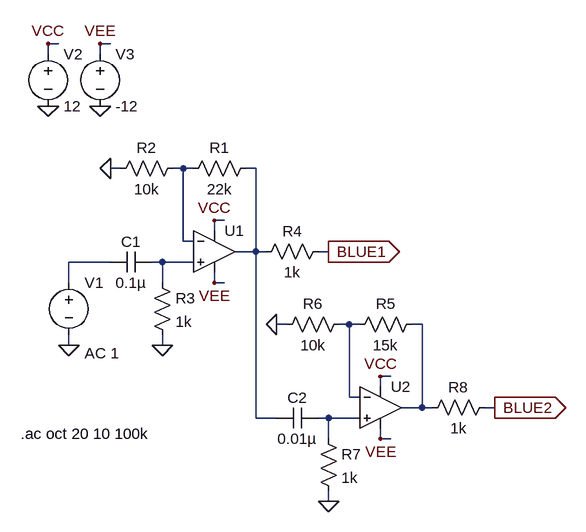
[diagram p0: schematic BlueFilter.asc]
BlueFilter.asc, the LTspice schematic file:
Version 4
SHEET 1 880 680
WIRE 32 -224 16 -224
WIRE 112 -224 96 -224
WIRE 16 -208 16 -224
WIRE 96 -208 96 -224
WIRE 128 -32 112 -32
WIRE 224 -32 208 -32
WIRE 240 -32 224 -32
WIRE 336 -32 320 -32
WIRE 288 48 272 48
WIRE 272 64 272 48
WIRE 224 80 224 -32
WIRE 240 80 224 80
WIRE 336 96 336 -32
WIRE 336 96 304 96
WIRE 352 96 336 96
WIRE 448 96 432 96
WIRE 112 112 48 112
WIRE 192 112 176 112
WIRE 240 112 192 112
WIRE 48 144 48 112
WIRE 192 144 192 112
WIRE 272 144 272 128
WIRE 288 144 272 144
WIRE 384 208 368 208
WIRE 480 208 464 208
WIRE 496 208 480 208
WIRE 592 208 576 208
WIRE 48 240 48 224
WIRE 192 240 192 224
WIRE 544 288 528 288
WIRE 528 304 528 288
WIRE 480 320 480 208
WIRE 496 320 480 320
WIRE 592 336 592 208
WIRE 592 336 560 336
WIRE 608 336 592 336
WIRE 704 336 688 336
WIRE 336 352 336 96
WIRE 368 352 336 352
WIRE 448 352 432 352
WIRE 496 352 448 352
WIRE 448 384 448 352
WIRE 528 384 528 368
WIRE 544 384 528 384
WIRE 448 480 448 464
FLAG 272 48 VCC
FLAG 272 144 VEE
FLAG 112 -32 0
FLAG 192 240 0
FLAG 48 240 0
FLAG 448 96 BLUE1
IOPIN 448 96 Out
FLAG 16 -128 0
FLAG 96 -128 0
FLAG 16 -224 VCC
FLAG 96 -224 VEE
FLAG 528 288 VCC
FLAG 528 384 VEE
FLAG 368 208 0
FLAG 448 480 0
FLAG 704 336 BLUE2
IOPIN 704 336 Out
SYMBOL voltage 48 128 R0
WINDOW 123 24 124 Left 2
WINDOW 39 0 0 Left 0
SYMATTR InstName V1
SYMATTR Value ""
SYMATTR Value2 AC 1
SYMBOL Opamps\\UniversalOpamp2 272 96 R0
SYMATTR InstName U1
SYMBOL res 336 -48 R90
WINDOW 0 0 56 VBottom 2
WINDOW 3 32 56 VTop 2
SYMATTR InstName R1
SYMATTR Value 22k
SYMBOL res 224 -48 R90
WINDOW 0 0 56 VBottom 2
WINDOW 3 32 56 VTop 2
SYMATTR InstName R2
SYMATTR Value 10k
SYMBOL res 176 128 R0
SYMATTR InstName R3
SYMATTR Value 1k
SYMBOL cap 176 96 R90
WINDOW 0 0 32 VBottom 2
WINDOW 3 32 32 VTop 2
SYMATTR InstName C1
SYMATTR Value 0.1µ
SYMBOL res 448 80 R90
WINDOW 0 0 56 VBottom 2
WINDOW 3 32 56 VTop 2
SYMATTR InstName R4
SYMATTR Value 1k
SYMBOL voltage 16 -224 R0
WINDOW 123 0 0 Left 0
WINDOW 39 0 0 Left 0
SYMATTR InstName V2
SYMATTR Value 12
SYMBOL voltage 96 -224 R0
WINDOW 123 0 0 Left 0
WINDOW 39 0 0 Left 0
SYMATTR InstName V3
SYMATTR Value -12
SYMBOL Opamps\\UniversalOpamp2 528 336 R0
SYMATTR InstName U2
SYMBOL res 592 192 R90
WINDOW 0 0 56 VBottom 2
WINDOW 3 32 56 VTop 2
SYMATTR InstName R5
SYMATTR Value 15k
SYMBOL res 480 192 R90
WINDOW 0 0 56 VBottom 2
WINDOW 3 32 56 VTop 2
SYMATTR InstName R6
SYMATTR Value 10k
SYMBOL res 432 368 R0
SYMATTR InstName R7
SYMATTR Value 1k
SYMBOL cap 432 336 R90
WINDOW 0 0 32 VBottom 2
WINDOW 3 32 32 VTop 2
SYMATTR InstName C2
SYMATTR Value 0.01µ
SYMBOL res 704 320 R90
WINDOW 0 0 56 VBottom 2
WINDOW 3 32 56 VTop 2
SYMATTR InstName R8
SYMATTR Value 1k
TEXT -26 376 Left 2 !.ac oct 20 10 100k

The netlist it stands for:
* BlueFilter.asc
V1 N003 0 AC 1
XU1 N004 N001 VCC VEE N002 level.2 Avol=1Meg GBW=10Meg Slew=10Meg ilimit=25m rail=0 Vos=0 phimargin=45 en=0 enk=0 in=0 ink=0 Rin=500Meg  ; pins IN+ IN- V+ V- OUT
R1 N002 N001 22k
R2 N001 0 10k
R3 N004 0 1k
C1 N004 N003 0.1µ
R4 BLUE1 N002 1k
V2 VCC 0 12
V3 VEE 0 -12
XU2 N007 N005 VCC VEE N006 level.2 Avol=1Meg GBW=10Meg Slew=10Meg ilimit=25m rail=0 Vos=0 phimargin=45 en=0 enk=0 in=0 ink=0 Rin=500Meg  ; pins IN+ IN- V+ V- OUT
R5 N006 N005 15k
R6 N005 0 10k
R7 N007 0 1k
C2 N007 N002 0.01µ
R8 BLUE2 N006 1k
.ac oct 20 10 100k
.lib UniversalOpamps2.sub
.backanno
.end